# Altium project OpenRex_V1I1.PrjPcb (part 5 of 13)

## Sheet [15] - ETHERNET PHY.SchDoc
size A2; DocumentNumber: 15; SheetNumber: 15; SheetTotal: 31
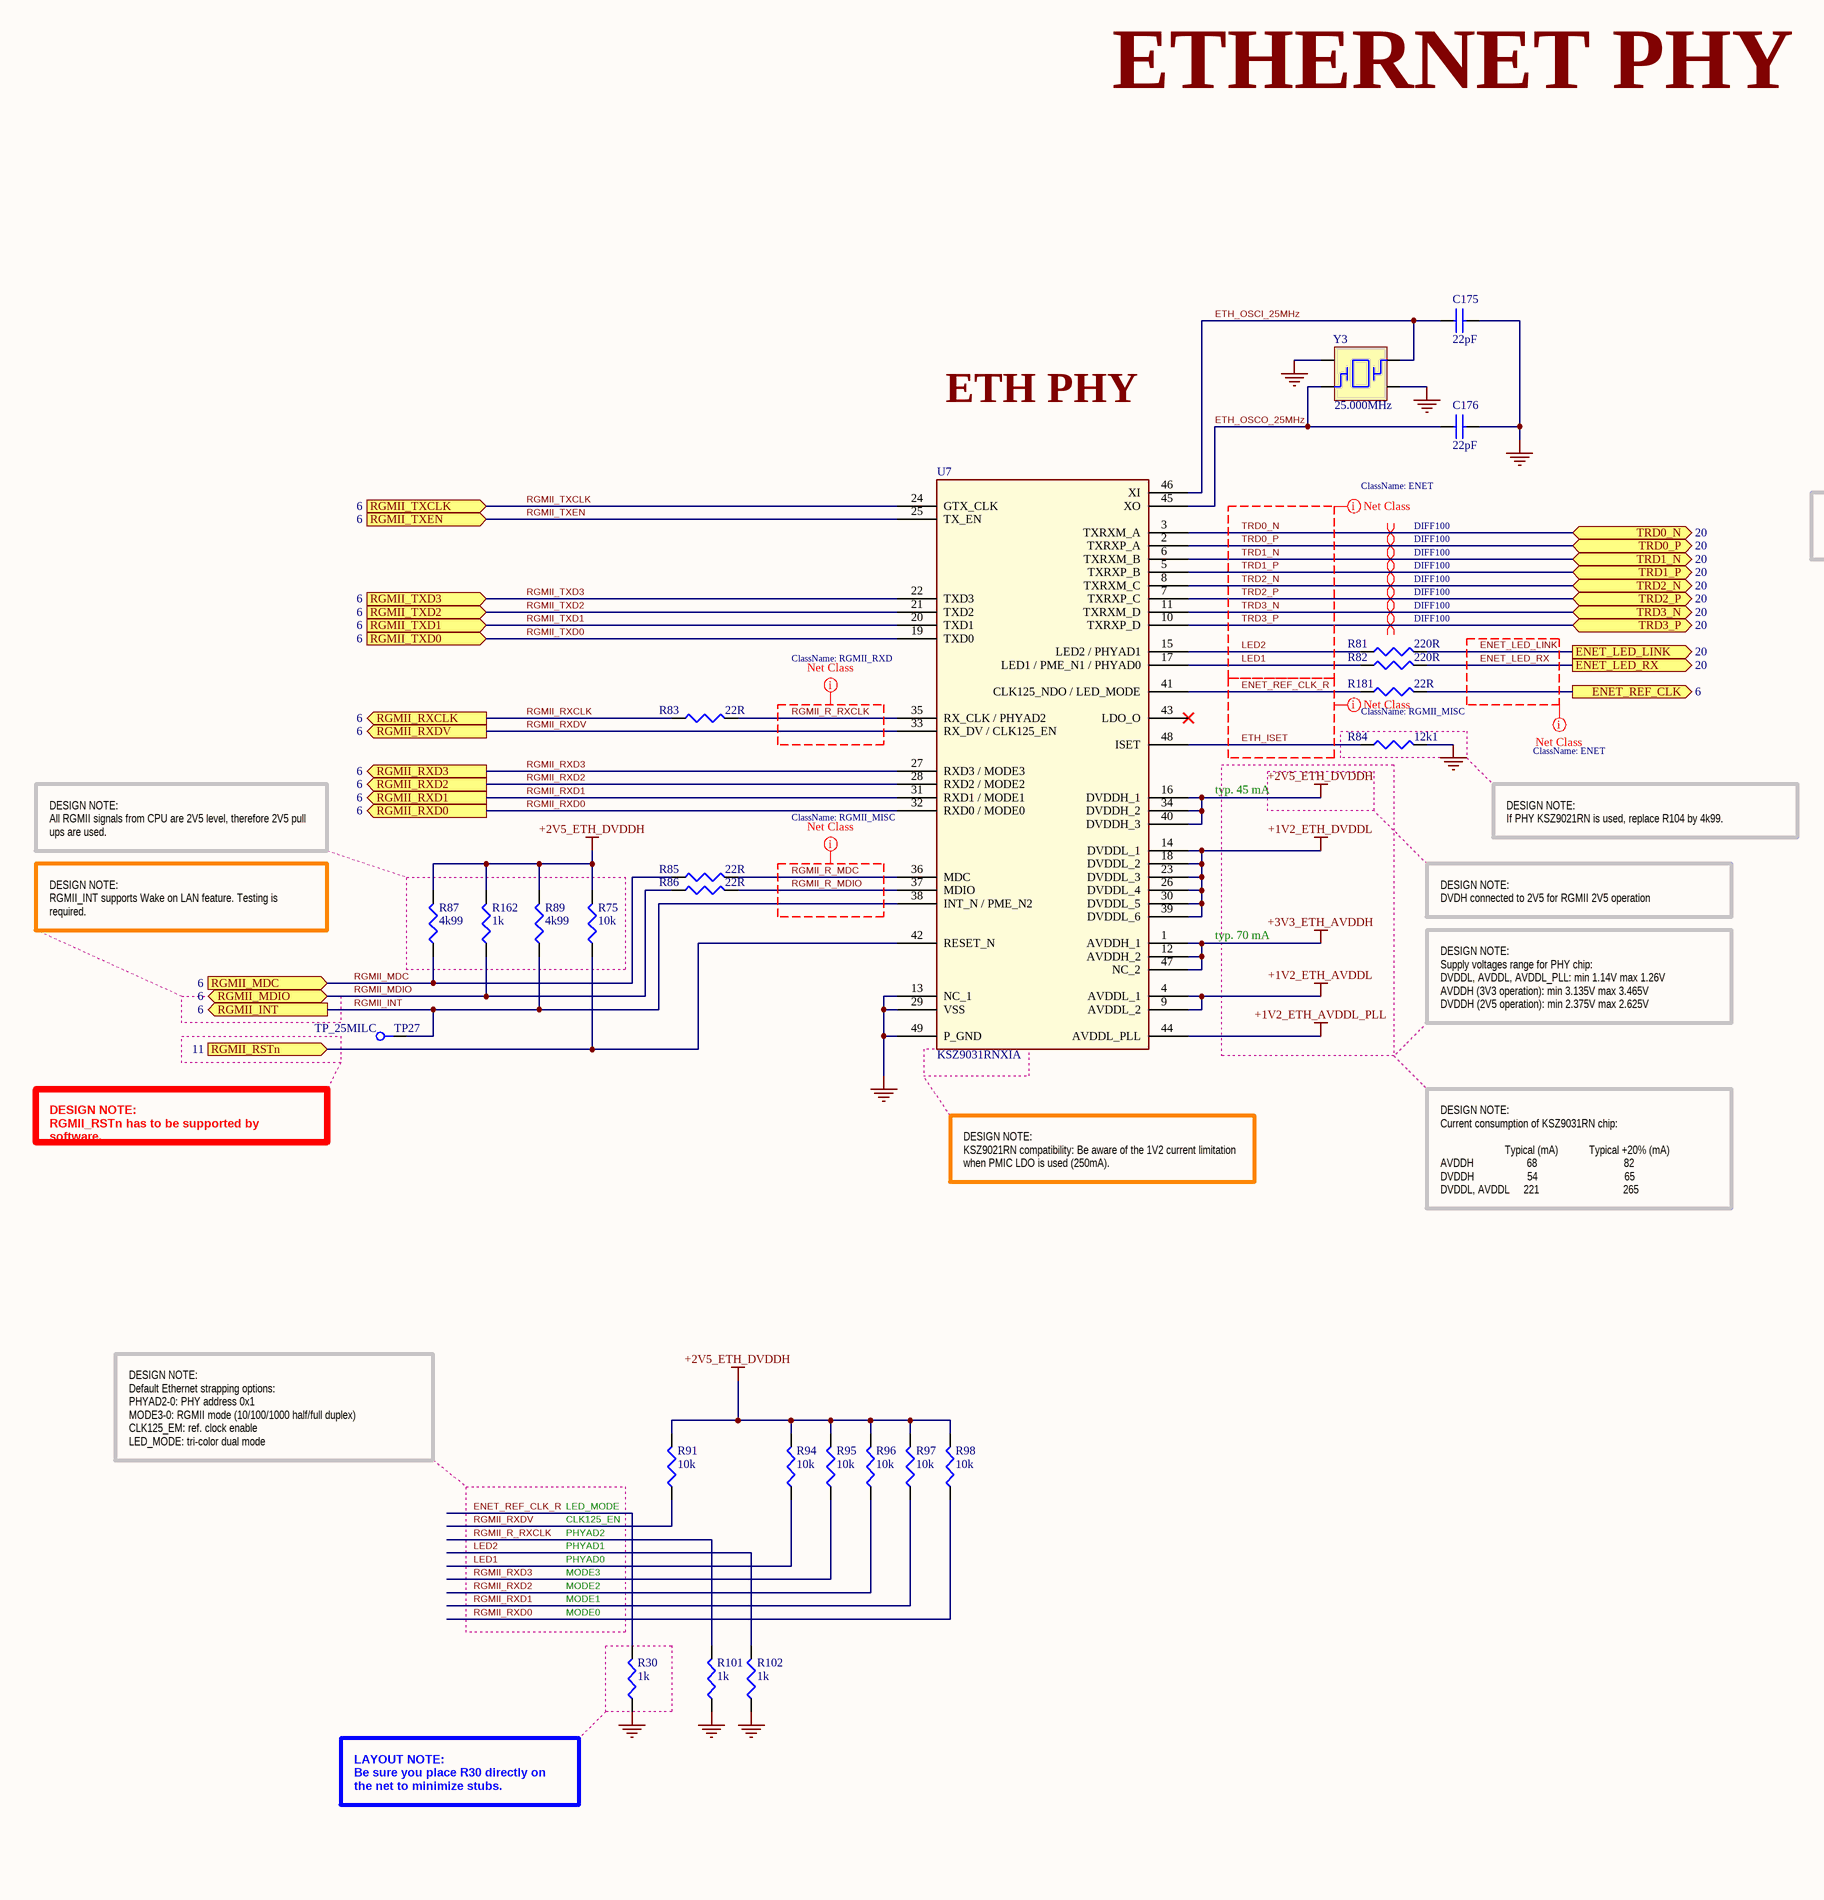
[diagram p23: [15] - ETHERNET PHY.SchDoc, left]
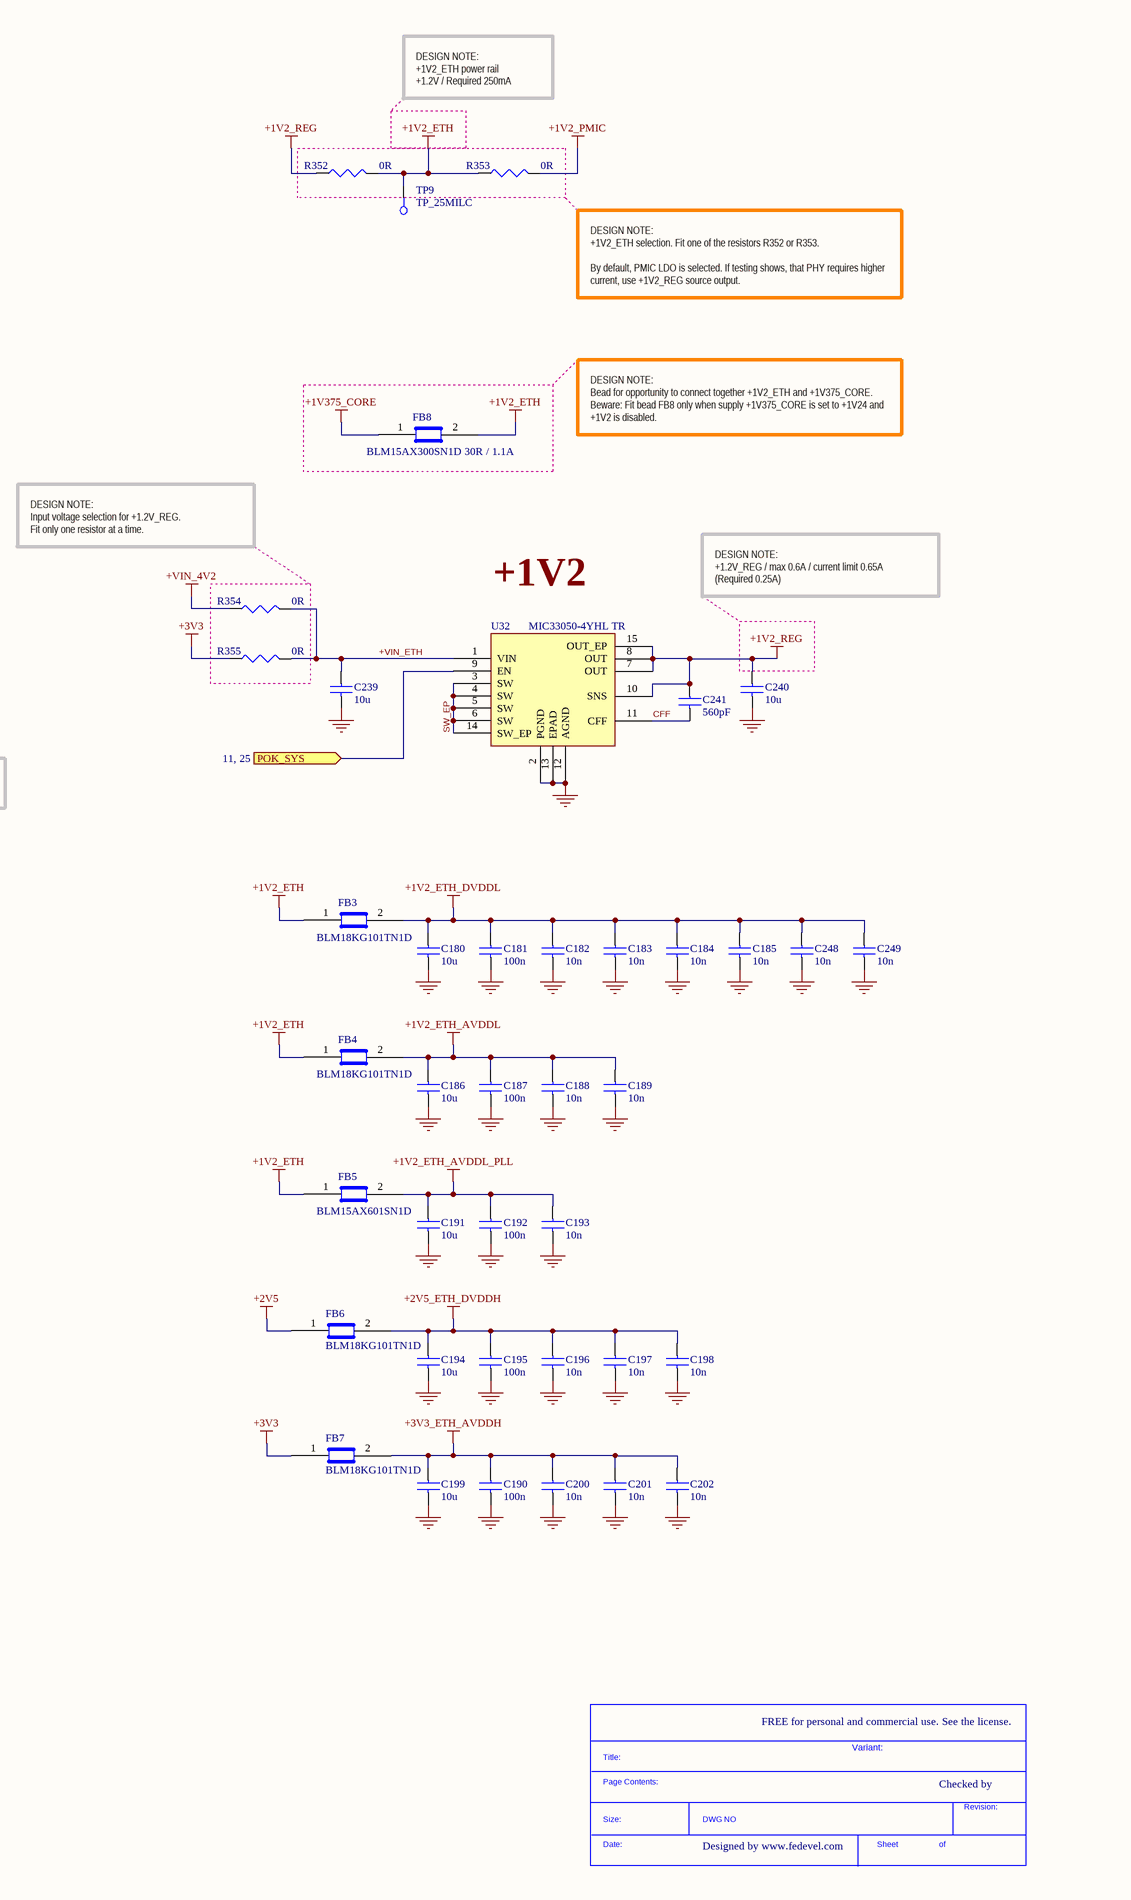
[diagram p24: [15] - ETHERNET PHY.SchDoc, right]

### Parts
(Parts that share a designator on the sheet are numbered #1, #2 ... from top to bottom, then left to right.)
*#15  SDTitleBlock  (value not drawn)  (graphical)
C175  22pF  [C0402]
C176  22pF  [C0402]
C180  10u  [C0603]
C181  100n  [C0402]
C182  10n  [C0402]
C183  10n  [C0402]
C184  10n  [C0402]
C185  10n  [C0402]
C186  10u  [C0603]
C187  100n  [C0402]
C188  10n  [C0402]
C189  10n  [C0402]
C190  100n  [C0402]
C191  10u  [C0603]
C192  100n  [C0402]
C193  10n  [C0402]
C194  10u  [C0603]
C195  100n  [C0402]
C196  10n  [C0402]
C197  10n  [C0402]
C198  10n  [C0402]
C199  10u  [C0603]
C200  10n  [C0402]
C201  10n  [C0402]
C202  10n  [C0402]
C239  10u  [C0603]
C240  10u  [C0603]
C241  560pF  [C0402]
C248  10n  [C0402]
C249  10n  [C0402]
FB3  BLM18KG101TN1D  [C0603]
FB4  BLM18KG101TN1D  [C0603]
FB5  BLM15AX601SN1D  [C0402]
FB6  BLM18KG101TN1D  [C0603]
FB7  BLM18KG101TN1D  [C0603]
FB8  BLM15AX300SN1D 30R / 1.1A  [C0402]
R30  1k  [R0402]
R75  10k  [R0402]
R81  220R  [R0402]
R82  220R  [R0402]
R83  22R  [R0402]
R84  12k1  [R0402]
R85  22R  [R0402]
R86  22R  [R0402]
R87  4k99  [R0402]
R89  4k99  [R0402]
R91  10k  [R0402]
R94  10k  [R0402]
R95  10k  [R0402]
R96  10k  [R0402]
R97  10k  [R0402]
R98  10k  [R0402]
R101  1k  [R0402]
R102  1k  [R0402]
R162  1k  [R0402]
R181  22R  [R0402]
R352  0R  [R0402]
R353  0R  [R0402]
R354  0R  [R0402]
R355  0R  [R0402]
TP9  TP_25MILC  [TP_25C]  (no BOM)
TP27  TP_25MILC  [TP_25C]  (no BOM)
U7  KSZ9031RNXIA  [QFN48_SMALL_EP_7MMX7MM]
U32  MIC33050-4YHL TR  [MLF_3x3_12PINS]
Y3  25.000MHz  [ABM8G]

### Ports
ENET_LED_LINK (out, see 20), ENET_LED_RX (out, see 20), ENET_REF_CLK (out, see 6), POK_SYS (see 11, 25), RGMII_INT (out, see 6), RGMII_MDC (in, see 6), RGMII_MDIO (bidir, see 6), RGMII_RSTn (in, see 11), RGMII_RXCLK (out, see 6), RGMII_RXD0 (out, see 6), RGMII_RXD1 (out, see 6), RGMII_RXD2 (out, see 6), RGMII_RXD3 (out, see 6), RGMII_RXDV (out, see 6), RGMII_TXCLK (in, see 6), RGMII_TXD0 (in, see 6), RGMII_TXD1 (in, see 6), RGMII_TXD2 (in, see 6), RGMII_TXD3 (in, see 6), RGMII_TXEN (in, see 6), TRD0_N (bidir, see 20), TRD0_P (bidir, see 20), TRD1_N (bidir, see 20), TRD1_P (bidir, see 20), TRD2_N (bidir, see 20), TRD2_P (bidir, see 20), TRD3_N (bidir, see 20), TRD3_P (bidir, see 20)

### Nets
+1V2_ETH: FB3.1 FB4.1 FB5.1 FB8.2 R352.2 R353.1 TP9.1
+1V2_ETH_AVDDL: C186.1 C187.1 C188.1 C189.1 FB4.2 U7.4(AVDDL_1) U7.9(AVDDL_2)
+1V2_ETH_AVDDL_PLL: C191.1 C192.1 C193.1 FB5.2 U7.44(AVDDL_PLL)
+1V2_ETH_DVDDL: C180.1 C181.1 C182.1 C183.1 C184.1 C185.1 C248.1 C249.1 FB3.2 U7.14(DVDDL_1) U7.18(DVDDL_2) U7.23(DVDDL_3) U7.26(DVDDL_4) U7.30(DVDDL_5) U7.39(DVDDL_6)
+1V2_PMIC: R353.2
+1V2_REG: C240.1 C241.1 R352.1 U32.7(OUT) U32.8(OUT) U32.10(SNS) U32.15(OUT_EP)
+1V375_CORE: FB8.1
+2V5: FB6.1
+2V5_ETH_DVDDH: C194.1 C195.1 C196.1 C197.1 C198.1 FB6.2 R75.2 R87.2 R89.2 R91.2 R94.2 R95.2 R96.2 R97.2 R98.2 R162.2 U7.16(DVDDH_1) U7.34(DVDDH_2) U7.40(DVDDH_3)
+3V3: FB7.1 R355.1
+3V3_ETH_AVDDH: C190.1 C199.1 C200.1 C201.1 C202.1 FB7.2 U7.1(AVDDH_1) U7.12(AVDDH_2) U7.47(NC_2)
+VIN_4V2: R354.1
GND: C175.2 C176.2 C180.2 C181.2 C182.2 C183.2 C184.2 C185.2 C186.2 C187.2 C188.2 C189.2 C190.2 C191.2 C192.2 C193.2 C194.2 C195.2 C196.2 C197.2 C198.2 C199.2 C200.2 C201.2 C202.2 C239.2 C240.2 C248.2 C249.2 R30.1 R84.2 R101.1 R102.1 U7.13(NC_1) U7.29(VSS) U7.49(P_GND) U32.2(PGND) U32.12(AGND) U32.13(EPAD) Y3.2 Y3.4
+VIN_ETH: C239.1 R354.2 R355.2 U32.1(VIN)
CFF: C241.2 U32.11(CFF)
ENET_LED_LINK: R81.2 ; port ENET_LED_LINK
ENET_LED_RX: R82.2 ; port ENET_LED_RX
ENET_REF_CLK: R181.2 ; port ENET_REF_CLK
ENET_REF_CLK_R: R30.2 R181.1 U7.41(CLK125_NDO_/_LED_MODE)
ETH_ISET: R84.1 U7.48(ISET)
ETH_OSCI_25MHz: C175.1 U7.46(XI) Y3.3
ETH_OSCO_25MHz: C176.1 U7.45(XO) Y3.1
LED1: R82.1 R94.1 U7.17(LED1_/_PME_N1_/_PHYAD0)
LED2: R81.1 R102.2 U7.15(LED2_/_PHYAD1)
POK_SYS: U32.9(EN) ; port POK_SYS
RGMII_INT: R89.1 TP27.1 U7.38(INT_N_/_PME_N2) ; port RGMII_INT
RGMII_MDC: R85.1 R87.1 ; port RGMII_MDC
RGMII_MDIO: R86.1 R162.1 ; port RGMII_MDIO
RGMII_R_MDC: R85.2 U7.36(MDC)
RGMII_R_MDIO: R86.2 U7.37(MDIO)
RGMII_R_RXCLK: R83.2 R101.2 U7.35(RX_CLK_/_PHYAD2)
RGMII_RSTn: R75.1 U7.42(RESET_N) ; port RGMII_RSTn
RGMII_RXCLK: R83.1 ; port RGMII_RXCLK
RGMII_RXD0: R98.1 U7.32(RXD0_/_MODE0) ; port RGMII_RXD0
RGMII_RXD1: R97.1 U7.31(RXD1_/_MODE1) ; port RGMII_RXD1
RGMII_RXD2: R96.1 U7.28(RXD2_/_MODE2) ; port RGMII_RXD2
RGMII_RXD3: R95.1 U7.27(RXD3_/_MODE3) ; port RGMII_RXD3
RGMII_RXDV: R91.1 U7.33(RX_DV_/_CLK125_EN) ; port RGMII_RXDV
RGMII_TXCLK: U7.24(GTX_CLK) ; port RGMII_TXCLK
RGMII_TXD0: U7.19(TXD0) ; port RGMII_TXD0
RGMII_TXD1: U7.20(TXD1) ; port RGMII_TXD1
RGMII_TXD2: U7.21(TXD2) ; port RGMII_TXD2
RGMII_TXD3: U7.22(TXD3) ; port RGMII_TXD3
RGMII_TXEN: U7.25(TX_EN) ; port RGMII_TXEN
SW_EP: U32.3(SW) U32.4(SW) U32.5(SW) U32.6(SW) U32.14(SW_EP)
TRD0_N: U7.3(TXRXM_A) ; port TRD0_N
TRD0_P: U7.2(TXRXP_A) ; port TRD0_P
TRD1_N: U7.6(TXRXM_B) ; port TRD1_N
TRD1_P: U7.5(TXRXP_B) ; port TRD1_P
TRD2_N: U7.8(TXRXM_C) ; port TRD2_N
TRD2_P: U7.7(TXRXP_C) ; port TRD2_P
TRD3_N: U7.11(TXRXM_D) ; port TRD3_N
TRD3_P: U7.10(TXRXP_D) ; port TRD3_P

Not connected (* = marked no-connect by the designer): U7 43(LDO_O)*

### Layout directives
differential pair; net class DIFF100: TRD0_N, TRD0_P, TRD1_N, TRD1_P, TRD2_N, TRD2_P, TRD3_N, TRD3_P
net class ENET: ENET_LED_LINK, ENET_LED_RX, LED1, LED2, TRD0_N, TRD0_P, TRD1_N, TRD1_P, TRD2_N, TRD2_P, TRD3_N, TRD3_P
net class RGMII_MISC: ENET_REF_CLK_R, ETH_ISET, RGMII_R_MDC, RGMII_R_MDIO
net class RGMII_RXD: RGMII_R_RXCLK

### Notes on the sheet
- ETHERNET PHY
- DESIGN NOTE:
  +1V2_ETH power rail
  +1.2V / Required 250mA
- DESIGN NOTE:
  +1V2_ETH selection. Fit one of the resistors R352 or R353.
  By default, PMIC LDO is selected. If testing shows, that PHY requires higher current, use +1V2_REG source output.
- ETH PHY
- DESIGN NOTE:
  Bead for opportunity to connect together +1V2_ETH and +1V375_CORE. Beware: Fit bead FB8 only when supply +1V375_CORE is set to +1V24 and +1V2 is disabled.
- DESIGN NOTE:
  Input voltage selection for +1.2V_REG.
  Fit only one resistor at a time.
- +1V2
- DESIGN NOTE:
  +1.2V_REG / max 0.6A / current limit 0.65A
  (Required 0.25A)
- typ. 45 mA
- DESIGN NOTE:
  If PHY KSZ9021RN is used, replace R104 by 4k99.
- DESIGN NOTE:
  All RGMII signals from CPU are 2V5 level, therefore 2V5 pull ups are used.
- DESIGN NOTE:
  RGMII_INT supports Wake on LAN feature. Testing is required.
- typ. 70 mA
- DESIGN NOTE:
  DVDH connected to 2V5 for RGMII 2V5 operation
- DESIGN NOTE:
  Supply voltages range for PHY chip:
  DVDDL, AVDDL, AVDDL_PLL: min 1.14V max 1.26V
  AVDDH (3V3 operation): min 3.135V max 3.465V
  DVDDH (2V5 operation): min 2.375V max 2.625V
- DESIGN NOTE:
  RGMII_RSTn has to be supported by software.
- DESIGN NOTE:
  KSZ9021RN compatibility: Be aware of the 1V2 current limitation when PMIC LDO is used (250mA).
- DESIGN NOTE:
  Current consumption of KSZ9031RN chip:
  Typical (mA)           Typical +20% (mA)
  AVDDH                   68                               82
  DVDDH                   54                               65
  DVDDL, AVDDL     221                              265
- DESIGN NOTE:
  Default Ethernet strapping options:
  PHYAD2-0: PHY address 0x1
  MODE3-0: RGMII mode (10/100/1000 half/full duplex)
  CLK125_EM: ref. clock enable
  LED_MODE: tri-color dual mode
- LED_MODE
- CLK125_EN
- PHYAD2
- PHYAD1
- PHYAD0
- MODE0
- MODE1
- MODE2
- MODE3
- LAYOUT NOTE:
  Be sure you place R30 directly on the net to minimize stubs.
- FREE for personal and commercial use. See the license.
- Variant:
- Checked by
- Designed by www.fedevel.com
- (in symbol SDTitleBlock) Title:; Page Contents:; Revision:; Size:; DWG NO; Date:; Sheet; of

### Library data of the parts
C175 C176 = C1005C0G1H220J: CAP CER 22PF 50V C0G 5% 0402; Manufacturer: TDK Corporation; .Checked PCB: used; Temperature Coefficient: C0G, NP0; Capacitance: 22pF; Category: Capacitors; Manufacturer Part Number: C1005C0G1H220J; Operating Temperature: -55°C ~ 125°C; Package / Case: 0402 (1005 Metric); Price 1k [$]: 0.00442; Value: 22pF; .Checked SCH: used; Voltage - Rated: 50V; Supplier Part Number: 445-1239-1-ND; Supplier: Digikey; Supplier 1: Digi-Key; Supplier Part Number 1: 445-1239-1-ND; RoHS: RoHS Compliant; Stock 1: 176261; Pricing 1: 1=0.08, 10=0.05, 100=0.018, 250=0.013, 500=0.0096, 1000=0.0065 (USD); Tolerance: ±5%; Mounting Type: Surface Mount, MLCC; Applications: General Purpose; Ratings: -; Size / Dimension: 0.039" L x 0.020" W (1.00mm x 0.50mm); Height - Seated (Max): -; Thickness (Max): 0.022" (0.55mm); Lead Spacing: -; Features: -; Packaging: Cut Tape (CT); Lead Style: -; ComponentLink1URL: http://www.tdk.co.jp/tefe02/e412_c.pdf; ComponentLink1Description: http://www.tdk.co.jp/tefe02/e412_c.pdf
C180 C186 C191 C194 C199 C239 C240 = C1608X5R0J106M: CAP CER 10UF 6.3V X5R 20% 0603; Manufacturer: TDK Corporation; Capacitance: 10µF; Value: 10µF; .Checked PCB: used; Category: Capacitors; Manufacturer Part Number: C1608X5R0J106M; Operating Temperature: -55°C ~ 85°C; Package / Case: 0603 (1608 Metric); Price 1k [$]: 0.08580; .Checked SCH: used; Voltage - Rated: 6.3V; Features: Low ESR; Supplier Part Number: 445-4112-1-ND; Supplier: Digikey; Supplier 1: Digi-Key; Supplier Part Number 1: 445-4112-1-ND; RoHS: RoHS Compliant; Stock 1: 48157; Pricing 1: 1=0.46, 10=0.363, 100=0.1898, 250=0.14024, 500=0.1089, 1000=0.0858 (USD); Tolerance: ±20%; Temperature Coefficient: X5R; Mounting Type: Surface Mount, MLCC; Applications: General Purpose; Ratings: -; Size / Dimension: 0.063" L x 0.031" W (1.60mm x 0.80mm); Height - Seated (Max): -; Thickness (Max): 0.037" (0.95mm); Lead Spacing: -; Packaging: Cut Tape (CT); Lead Style: -; ComponentLink1URL: http://www.tdk.com/pdf/general_B11.pdf; ComponentLink1Description: http://www.tdk.com/pdf/general_B11.pdf
C181 C187 C190 C192 C195 = C1005X5R1H104K: CAP CER .10UF 50V X5R 10% 0402; Manufacturer: TDK Corporation; Capacitance: 0.1µF; Value: 100nF; .Checked PCB: used; Category: Capacitors; Manufacturer Part Number: C1005X5R1H104K; Operating Temperature: -55°C ~ 85°C; Package / Case: 0402 (1005 Metric); Price 1k [$]: 0.02340; .Checked SCH: used; Voltage - Rated: 50V; Supplier Part Number: 445-5942-1-ND; Supplier: Digikey; Supplier 1: Digi-Key; Supplier Part Number 1: 445-5942-1-ND; RoHS: RoHS Compliant; Stock 1: 106926; Pricing 1: 1=0.27, 10=0.18, 100=0.072, 250=0.05176, 500=0.0369, 1000=0.027 (USD); Tolerance: ±10%; Temperature Coefficient: X5R; Mounting Type: Surface Mount, MLCC; Applications: General Purpose; Ratings: -; Size / Dimension: 0.039" L x 0.020" W (1.00mm x 0.50mm); Height - Seated (Max): -; Thickness (Max): 0.022" (0.55mm); Lead Spacing: -; Features: -; Packaging: Cut Tape (CT); Lead Style: -; ComponentLink1URL: http://www.tdk.co.jp/tefe02/e412_c.pdf; ComponentLink1Description: http://www.tdk.co.jp/tefe02/e412_c.pdf
C182-C185 C188 C189 C193 C196-C198 C200-C202 C248 C249 = C1005X7R1H103K: CAP CER 10000PF 50V 10% X7R 0402; Manufacturer: TDK Corporation; Value: 10nF; .Checked PCB: used; Capacitance: 10000pF; Category: Capacitors; Manufacturer Part Number: C1005X7R1H103K; Operating Temperature: -55°C ~ 125°C; Package / Case: 0402 (1005 Metric); Price 1k [$]: 0.01625; .Checked SCH: used; Voltage - Rated: 50V; Supplier Part Number: 445-6850-1-ND; Supplier: Digikey; Supplier 1: Digi-Key; Supplier Part Number 1: 445-6850-1-ND; RoHS: RoHS Compliant; Stock 1: 3901; Pricing 1: 1=0.2, 10=0.125, 100=0.045, 250=0.03252, 500=0.024, 1000=0.01625 (USD); Tolerance: ±10%; Temperature Coefficient: X7R; Mounting Type: Surface Mount, MLCC; Applications: General Purpose; Ratings: -; Size / Dimension: 0.039" L x 0.020" W (1.00mm x 0.50mm); Height - Seated (Max): -; Thickness (Max): 0.022" (0.55mm); Lead Spacing: -; Features: -; Packaging: Cut Tape (CT); Lead Style: -; ComponentLink1URL: http://www.tdk.co.jp/tefe02/e412_c.pdf; ComponentLink1Description: http://www.tdk.co.jp/tefe02/e412_c.pdf
C241 = GRM1555C1H561JA01D: CAP CER 560PF 50V C0G 0402; Manufacturer: Murata Electronics North America; .Checked PCB: used; Tolerance: ±5%; Temperature Coefficient: C0G, NP0; Capacitance: 560pF; Category: Capacitors; Supplier Part Number: 490-3238-1-ND; Manufacturer Part Number: GRM1555C1H561JA01D; Operating Temperature: -55°C ~ 125°C; Package / Case: 0402 (1005 Metric); Price 1k [$]: 0.0149; Value: 560pF; .Checked SCH: used; Voltage - Rated: 50V; Supplier: Digikey; Supplier 1: Digi-Key; Supplier Part Number 1: 490-3238-1-ND; RoHS: RoHS Compliant; Stock 1: 301161; Pricing 1: 10=0.066, 50=0.0528, 100=0.0396, 250=0.0286, 500=0.02112, 1000=0.0143, 5000=0.011 (USD); Mounting Type: Surface Mount, MLCC; Applications: General Purpose; Ratings: -; Size / Dimension: 0.039" L x 0.020" W (1.00mm x 0.50mm); Height - Seated (Max): -; Thickness (Max): 0.022" (0.55mm); Lead Spacing: -; Features: -; Packaging: Cut Tape (CT); Lead Style: -; ComponentLink1URL: http://search.murata.co.jp/Ceramy/image/img/PDF/ENG/GRM1555C1H561JA01.pdf; ComponentLink1Description: http://search.murata.co.jp/Ceramy/image/img/PDF/ENG/GRM1555C1H561JA01.pdf
FB3 FB4 FB6 FB7 = BLM18KG101TN1D: FERRITE CHIP 100 OHM BEAD 0603 3A; Manufacturer: Murata Electronics North America; .Checked PCB: used; Impedance @ Frequency: 100 Ohm @ 100MHz; DC Resistance (DCR): 30 mOhm Max; Filter Type: Differential Mode - Single; Number of Lines: 1; .Checked SCH: used; Category: Filters; Manufacturer Part Number: BLM18KG101TN1D; Package / Case: 0603 (1608 Metric); Price 1k [$]: 0.04320; Value: BLM18KG101TN1D; Current Rating: 3A; Supplier Part Number: 490-5448-1-ND; Supplier: Digikey; Supplier 1: Digi-Key; Supplier Part Number 1: 490-5448-1-ND; RoHS: RoHS Compliant; Stock 1: 10314; Pricing 1: 1=0.35, 10=0.23, 50=0.1196, 100=0.0922, 250=0.06624, 500=0.04724, 1000=0.03456 (USD); Mounting Type: Surface Mount; Packaging: Cut Tape (CT); Height (Max): 0.030" (0.75mm); Size / Dimension: 0.063" L x 0.031" W (1.60mm x 0.80mm); ComponentLink1URL: http://search.murata.co.jp/Ceramy/image/img/PDF/ENG/L0110S0100BLM18K.pdf; ComponentLink1Description: http://search.murata.co.jp/Ceramy/image/img/PDF/ENG/L0110S0100BLM18K.pdf
FB5 = BLM15AX601SN1D: FERRITE CHIP 600 OHM 0402 420mA; Manufacturer: Murata Electronics North America; .Checked PCB: used; Impedance @ Frequency: 600 Ohm @ 100MHz; DC Resistance (DCR): 340 mOhm Max; Filter Type: Differential Mode - Single; Number of Lines: 1; .Checked SCH: used; Category: Filters; Manufacturer Part Number: BLM15AX601SN1D; Package / Case: 0402 (1005 Metric); Current Rating: 420mA; Supplier 1: Digi-Key; Supplier Part Number 1: 490-5441-1-ND; RoHS: RoHS Compliant; Stock 1: 34008; Pricing 1: 1=0.26, 10=0.197, 50=0.1148, 100=0.0918, 250=0.0656, 500=0.0446, 1000=0.03608, 5000=0.02821 (USD); Mounting Type: Surface Mount; Packaging: Cut Tape (CT); Height (Max): 0.022" (0.55mm); Size / Dimension: 0.039" L x 0.020" W (1.00mm x 0.50mm); ComponentLink1URL: http://search.murata.co.jp/Ceramy/image/img/PDF/ENG/L0110S0100BLM15AX_SN.pdf; ComponentLink1Description: http://search.murata.co.jp/Ceramy/image/img/PDF/ENG/L0110S0100BLM15AX_SN.pdf; Supplier Part Number: 490-5441-1-ND; Price 1k [$]: 0.03280; Value: BLM15AX601SN1D; Supplier: Digikey
FB8 = BLM15AX300SN1D: FERRITE CHIP 30 OHM 1100MA 0402; Manufacturer: Murata Electronics North America; Impedance @ Frequency: 30 Ohm @ 100MHz; DC Resistance (DCR): 60 mOhm Max; Filter Type: Differential Mode - Single; Number of Lines: 1; .Checked PCB: MM; Supplier 1: Digi-Key; Supplier Part Number 1: 490-5682-1-ND; Manufacturer Part Number: BLM15AX300SN1D; RoHS: RoHS Compliant; Category: Filters; Stock 1: 29684; Pricing 1: 1=0.26, 10=0.194, 50=0.1134, 100=0.0907, 250=0.0648, 500=0.04406, 1000=0.03564, 5000=0.02786 (USD); Current Rating: 1.1A; Package / Case: 0402 (1005 Metric); Mounting Type: Surface Mount; Packaging: Cut Tape (CT); Height (Max): 0.022" (0.55mm); Size / Dimension: 0.039" L x 0.020" W (1.00mm x 0.50mm); ComponentLink1URL: http://search.murata.co.jp/Ceramy/image/img/PDF/ENG/L0110S0100BLM15AX_SN.pdf; ComponentLink1Description: http://search.murata.co.jp/Ceramy/image/img/PDF/ENG/L0110S0100BLM15AX_SN.pdf; .Checked SCH: MM
R30 R101 R102 R162 = RC0402FR-071KL: RES 1.00K OHM 1/16W 1% 0402 SMD; Manufacturer: Yageo; Power (Watts): 0.063W, 1/16W; .Checked PCB: used; Temperature Coefficient: ±100ppm/°C; Category: Resistors; Manufacturer Part Number: RC0402FR-071KL; Package / Case: 0402 (1005 Metric); Price 1k [$]: 0.01421; Resistance (Ohms): 1K; Tolerance: ±1%; Value: 1k; .Checked SCH: used; Supplier Part Number: 311-1.00KLRCT-ND; Supplier: Digikey; Supplier 1: Digi-Key; Supplier Part Number 1: 311-1.00KLRCT-ND; RoHS: RoHS Compliant; Stock 1: 1753477; Pricing 1: 10=0.014, 50=0.0104, 100=0.0079, 250=0.00584, 500=0.00432, 1000=0.00288 (USD); Composition: Thick Film; Features: -; Size / Dimension: 0.039" L x 0.020" W (1.00mm x 0.50mm); Height: 0.016" (0.40mm); Number of Terminations: 2; Packaging: Cut Tape (CT); ComponentLink1URL: http://www.yageo.com/documents/recent/PYu-RC0402_51_RoHS_L_6.pdf; ComponentLink1Description: http://www.yageo.com/documents/recent/PYu-RC0402_51_RoHS_L_6.pdf
R75 R91 R94-R98 = RC0402FR-0710KL: RES 10.0K OHM 1/16W 1% 0402 SMD; Manufacturer: Yageo; Power (Watts): 0.063W, 1/16W; .Checked PCB: used; Temperature Coefficient: ±100ppm/°C; Category: Resistors; Supplier Part Number: 311-10.0KLRCT-ND; Manufacturer Part Number: RC0402FR-0710KL; Package / Case: 0402 (1005 Metric); Price 1k [$]: 0.01421; Resistance (Ohms): 10K; Tolerance: ±1%; Value: 10k; .Checked SCH: used; Supplier: Digikey; Supplier 1: Digi-Key; Supplier Part Number 1: 311-10.0KLRCT-ND; RoHS: RoHS Compliant; Stock 1: 2916495; Pricing 1: 10=0.014, 50=0.0104, 100=0.0079, 250=0.00584, 500=0.00432, 1000=0.00288 (USD); Composition: Thick Film; Features: -; Size / Dimension: 0.039" L x 0.020" W (1.00mm x 0.50mm); Height: 0.016" (0.40mm); Number of Terminations: 2; Packaging: Cut Tape (CT); ComponentLink1URL: http://www.yageo.com/documents/recent/PYu-RC0402_51_RoHS_L_6.pdf; ComponentLink1Description: http://www.yageo.com/documents/recent/PYu-RC0402_51_RoHS_L_6.pdf
R81 R82 = RC0402FR-07220RL: RES 220 OHM 1/16W 1% 0402 SMD; Manufacturer: Yageo; Resistance (Ohms): 220; Power (Watts): 0.063W, 1/16W; .Checked PCB: used; Temperature Coefficient: ±100ppm/°C; Category: Resistors; Manufacturer Part Number: RC0402FR-07220RL; Package / Case: 0402 (1005 Metric); Price 1k [$]: 0.01421; Tolerance: ±1%; Value: 220R; .Checked SCH: used; Supplier Part Number: 311-220LRCT-ND; Supplier: Digikey; Supplier 1: Digi-Key; Supplier Part Number 1: 311-220LRCT-ND; RoHS: RoHS Compliant; Stock 1: 276463; Pricing 1: 10=0.014, 50=0.0104, 100=0.0079, 250=0.00584, 500=0.00432, 1000=0.00288 (USD); Composition: Thick Film; Features: -; Size / Dimension: 0.039" L x 0.020" W (1.00mm x 0.50mm); Height: 0.016" (0.40mm); Number of Terminations: 2; Packaging: Cut Tape (CT); ComponentLink1URL: http://www.yageo.com/documents/recent/PYu-RC0402_51_RoHS_L_6.pdf; ComponentLink1Description: http://www.yageo.com/documents/recent/PYu-RC0402_51_RoHS_L_6.pdf
R83 R85 R86 R181 = RC0402FR-0722RL: RES 22.0 OHM 1/16W 1% 0402 SMD; Manufacturer: Yageo; Resistance (Ohms): 22; Power (Watts): 0.063W, 1/16W; .Checked PCB: used; Temperature Coefficient: ±100ppm/°C; Category: Resistors; Manufacturer Part Number: RC0402FR-0722RL; Package / Case: 0402 (1005 Metric); Price 1k [$]: 0.01421; Tolerance: ±1%; Value: 22R; .Checked SCH: used; Supplier Part Number: 311-22.0LRCT-ND; Supplier: Digikey; Supplier 1: Digi-Key; Supplier Part Number 1: 311-22.0LRCT-ND; RoHS: RoHS Compliant; Stock 1: 943800; Pricing 1: 10=0.014, 50=0.0104, 100=0.0079, 250=0.00584, 500=0.00432, 1000=0.00288 (USD); Composition: Thick Film; Features: -; Size / Dimension: 0.039" L x 0.020" W (1.00mm x 0.50mm); Height: 0.016" (0.40mm); Number of Terminations: 2; Packaging: Cut Tape (CT); ComponentLink1URL: http://www.yageo.com/documents/recent/PYu-RC0402_51_RoHS_L_6.pdf; ComponentLink1Description: http://www.yageo.com/documents/recent/PYu-RC0402_51_RoHS_L_6.pdf
R84 = RC0402FR-0712K1L: RES SMD 12.1K OHM 1% 1/16W 0402; Manufacturer: Yageo; Power (Watts): 0.063W, 1/16W; Temperature Coefficient: ±100ppm/°C; .Creator: MM; Supplier 1: Digi-Key; Manufacturer Part Number: RC0402FR-0712K1L; RoHS: RoHS Compliant; Category: Resistors; Stock 1: 327554; Pricing 1: 1=0.1, 10=0.015, 25=0.0108, 100=0.006, 250=0.00456, 500=0.00364, 1000=0.00268, 2500=0.00233, 5000=0.00192 (USD); Packaging: Cut Tape (CT); Resistance (Ohms): 12.1k; Tolerance: ±1%; Composition: Thick Film; Features: Moisture Resistant; Operating Temperature: -55°C ~ 155°C; Package / Case: 0402 (1005 Metric); Supplier Device Package: 0402; Size / Dimension: 0.039" L x 0.020" W (1.00mm x 0.50mm); Height: 0.016" (0.40mm); Number of Terminations: 2; ComponentLink1URL: http://www.yageo.com/NewPortal/yageodocoutput?fileName=/pdf/R-Chip/PYu-RC_Group_51_RoHS_L_0.pdf; ComponentLink1Description: http://www.yageo.com/NewPortal/yageodocoutput?fileName=/pdf/R-Chip/PYu-RC_Group_51_RoHS_L_0.pdf; Supplier Part Number 1: 311-12.1KLRCT-ND; .Checked PCB: MM; .Checked SCH: MM
R87 R89 = RMCF0402FT4K99: RES TF 4.99K OHM 1% 1/16W 0402; Manufacturer: Stackpole Electronics Inc; Power (Watts): 0.063W, 1/16W; .Checked PCB: used; Temperature Coefficient: ±100ppm/°C; Category: Resistors; Manufacturer Part Number: RMCF0402FT4K99; Package / Case: 0402 (1005 Metric); Price 1k [$]: 0.00384; Resistance (Ohms): 4.99K; Tolerance: ±1%; Value: 4k99; .Checked SCH: used; Supplier Part Number: RMCF0402FT4K99CT-ND; Supplier: Digikey; Supplier 1: Digi-Key; Supplier Part Number 1: RMCF0402FT4K99CT-ND; RoHS: RoHS Compliant; Stock 1: 48509; Pricing 1: 1=0.04, 10=0.025, 50=0.0138, 100=0.0105, 250=0.0078, 500=0.00576, 1000=0.00384 (USD); Composition: Thick Film; Features: -; Size / Dimension: 0.039" L x 0.020" W (1.00mm x 0.50mm); Height: 0.016" (0.40mm); Number of Terminations: 2; Packaging: Cut Tape (CT); ComponentLink1URL: http://www.seielect.com/Catalog/SEI-RMCF.pdf; ComponentLink1Description: http://www.seielect.com/Catalog/SEI-RMCF.pdf
R352-R355 = RC0402JR-070RL: RES 0.0 OHM 1/16W 0402 SMD; Manufacturer: Yageo; Resistance (Ohms): 0.0; Power (Watts): 0.063W, 1/16W; Tolerance: Jumper; .Checked PCB: used; Category: Resistors; Supplier Part Number: 311-0.0JRCT-ND; Manufacturer Part Number: RC0402JR-070RL; Package / Case: 0402 (1005 Metric); Price 1k [$]: 0.01389; Value: 0R; .Checked SCH: used; Supplier: Digikey; Supplier 1: Digi-Key; Supplier Part Number 1: 311-0.0JRCT-ND; RoHS: RoHS Compliant; Stock 1: 1106330; Pricing 1: 10=0.012, 50=0.009, 100=0.0069, 250=0.00512, 500=0.0038, 1000=0.00253 (USD); Composition: Thick Film; Features: -; Temperature Coefficient: -; Size / Dimension: 0.039" L x 0.020" W (1.00mm x 0.50mm); Height: 0.016" (0.40mm); Number of Terminations: 2; Packaging: Cut Tape (CT); ComponentLink1URL: http://www.yageo.com/documents/recent/PYu-RC0402_51_RoHS_L_6.pdf; ComponentLink1Description: http://www.yageo.com/documents/recent/PYu-RC0402_51_RoHS_L_6.pdf
TP9 TP27 = TP_25MILC: Test Point 25mil
U7 = KSZ9031RNXIA: IC TXRX ETHERNET 48-QFN; Manufacturer: Micrel Inc; Number of Drivers/Receivers: 4/4; Duplex: Full; Voltage - Supply: 1.8V, 2.5V, 3.3V; .Creator: MM; Supplier 1: Digi-Key; Manufacturer Part Number: KSZ9031RNXIA; RoHS: RoHS Compliant; Category: Integrated Circuits (ICs); Stock 1: 1755; Pricing 1: 1=6.69, 10=5.975, 50=5.3776, 100=4.8995, 250=4.42152, 500=3.9674, 1000=3.346, 2500=3.1787, 5000=3.04725 (USD); Packaging: Tray; Type: Transceiver; Protocol: Ethernet; Receiver Hysteresis: -; Data Rate: -; Operating Temperature: -40°C ~ 85°C; Mounting Type: Surface Mount; Package / Case: 48-VFQFN Exposed Pad; Supplier Device Package: 48-QFN (7x7); ComponentLink1URL: http://www.micrel.com/_PDF/Ethernet/datasheets/KSZ9031RNX.pdf; ComponentLink1Description: http://www.micrel.com/_PDF/Ethernet/datasheets/KSZ9031RNX.pdf; Supplier Part Number 1: 576-4346-ND; .Checked PCB: MM; .Checked SCH: MM
U32 = MIC33050-4YHL TR: IC PWM REG 600mA 1.2V 12-MLF; Manufacturer: Micrel Inc; .Checked PCB: used; Voltage - Input: 2.7 V ~ 5.5 V; Output Type: Fixed; Number of Outputs: 1; PWM Type: Current Mode; Frequency - Switching: 4MHz; Synchronous Rectifier: Yes; .Checked SCH: used; Category: Integrated Circuits (ICs); Supplier Part Number: 576-3044-1-ND; Family: PMIC - Voltage Regulators - Switching DC DC Converters & Controllers; Manufacturer Part Number: MIC33050-4YHL TR; Operating Temperature: -40°C ~ 125°C; Package / Case: 12-MLF®, QFN; Price 1k [$]: 1.62500; Value: MIC33050-4YHL TR; Voltage - Output: 1.2V; Current - Output: 600mA; Supplier: Digikey; Supplier 1: Digi-Key; Supplier Part Number 1: 576-3044-1-ND; RoHS: RoHS Compliant; Stock 1: 1750; Pricing 1: 1=2.34, 25=1.872, 100=1.456, 250=1.3832, 500=1.352 (USD); Type: Step-Down (Buck); Mounting Type: Surface Mount; Packaging: Cut Tape (CT); Supplier Device Package: 12-MLF™ (3x3); ComponentLink1URL: http://www.micrel.com/_PDF/mic33050.pdf; ComponentLink1Description: http://www.micrel.com/_PDF/mic33050.pdf
Y3 = ABM8G-25.000MHZ-18-D2Y-T: CRYSTAL 25MHZ 18PF SMD; Manufacturer: Abracon Corporation; Frequency Stability: ±30ppm; Frequency Tolerance: ±20ppm; ESR (Equivalent Series Resistance): 60 Ohm; Operating Mode: Fundamental; .Checked PCB: MM; Supplier 1: Digi-Key; Manufacturer Part Number: ABM8G-25.000MHZ-18-D2Y-T; RoHS: RoHS Compliant; Category: Crystals and Oscillators; Stock 1: 25549; Pricing 1: 1=1.06, 10=0.944, 50=0.8814, 100=0.78, 500=0.7371 (USD); Packaging: Cut Tape (CT); Type: MHz Crystal; Frequency: 25MHz; Load Capacitance: 18pF; Operating Temperature: -40°C ~ 85°C; Ratings: -; Mounting Type: Surface Mount; Package / Case: 4-SMD, No Lead (DFN, LCC); Size / Dimension: 0.126" L x 0.098" W (3.20mm x 2.50mm); Height: 0.039" (1.00mm); ComponentLink1URL: http://www.abracon.com/Resonators/ABM8G.pdf; ComponentLink1Description: http://www.abracon.com/Resonators/ABM8G.pdf; Supplier Part Number 1: 535-10275-1-ND; .Checked SCH: MM; .Creator: MM